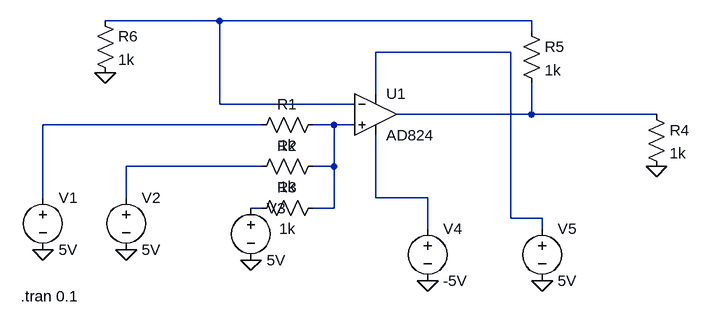
[diagram p0: schematic Draft4.asc]
Draft4.asc, the LTspice schematic file:
Version 4
SHEET 1 880 680
WIRE -80 16 -256 16
WIRE 400 16 -80 16
WIRE 400 32 400 16
WIRE 368 64 160 64
WIRE 160 128 160 64
WIRE -80 144 -80 16
WIRE 128 144 -80 144
WIRE 400 160 400 112
WIRE 400 160 192 160
WIRE 592 160 400 160
WIRE -16 176 -352 176
WIRE 96 176 64 176
WIRE 128 176 96 176
WIRE -16 240 -224 240
WIRE 96 240 96 176
WIRE 96 240 64 240
WIRE -352 288 -352 176
WIRE -224 288 -224 240
WIRE 160 288 160 192
WIRE 240 288 160 288
WIRE -16 304 -32 304
WIRE 96 304 96 240
WIRE 96 304 64 304
WIRE 368 320 368 64
WIRE 416 320 368 320
WIRE 240 336 240 288
WIRE 416 336 416 320
FLAG -32 384 0
FLAG -224 368 0
FLAG -352 368 0
FLAG 592 240 0
FLAG -256 96 0
FLAG 416 416 0
FLAG 240 416 0
SYMBOL OpAmps\\AD824 160 96 R0
SYMATTR InstName U1
SYMBOL res 80 160 R90
WINDOW 0 0 56 VBottom 2
WINDOW 3 32 56 VTop 2
SYMATTR InstName R1
SYMATTR Value 1k
SYMBOL res 80 224 R90
WINDOW 0 0 56 VBottom 2
WINDOW 3 32 56 VTop 2
SYMATTR InstName R2
SYMATTR Value 1k
SYMBOL res 80 288 R90
WINDOW 0 0 56 VBottom 2
WINDOW 3 32 56 VTop 2
SYMATTR InstName R3
SYMATTR Value 1k
SYMBOL voltage -352 272 R0
WINDOW 123 0 0 Left 0
WINDOW 39 0 0 Left 0
SYMATTR InstName V1
SYMATTR Value 5V
SYMBOL voltage -224 272 R0
WINDOW 123 0 0 Left 0
WINDOW 39 0 0 Left 0
SYMATTR InstName V2
SYMATTR Value 5V
SYMBOL voltage -32 288 R0
WINDOW 123 0 0 Left 0
WINDOW 39 0 0 Left 0
SYMATTR InstName V3
SYMATTR Value 5V
SYMBOL res 576 144 R0
SYMATTR InstName R4
SYMATTR Value 1k
SYMBOL res 384 16 R0
SYMATTR InstName R5
SYMATTR Value 1k
SYMBOL res -272 0 R0
SYMATTR InstName R6
SYMATTR Value 1k
SYMBOL voltage 240 320 R0
WINDOW 123 0 0 Left 0
WINDOW 39 0 0 Left 0
SYMATTR InstName V4
SYMATTR Value -5V
SYMBOL voltage 416 320 R0
WINDOW 123 0 0 Left 0
WINDOW 39 0 0 Left 0
SYMATTR InstName V5
SYMATTR Value 5V
TEXT -386 440 Left 2 !.tran 0.1

The netlist it stands for:
* Draft4.asc
XU1 N005 N001 N002 N007 N003 AD824  ; pins In+ In- V+ V- OUT
R1 N005 N004 1k
R2 N005 N006 1k
R3 N005 N008 1k
V1 N004 0 5V
V2 N006 0 5V
V3 N008 0 5V
R4 N003 0 1k
R5 N001 N003 1k
R6 N001 0 1k
V4 N007 0 -5V
V5 N002 0 5V
.tran 0.1
.backanno
.end